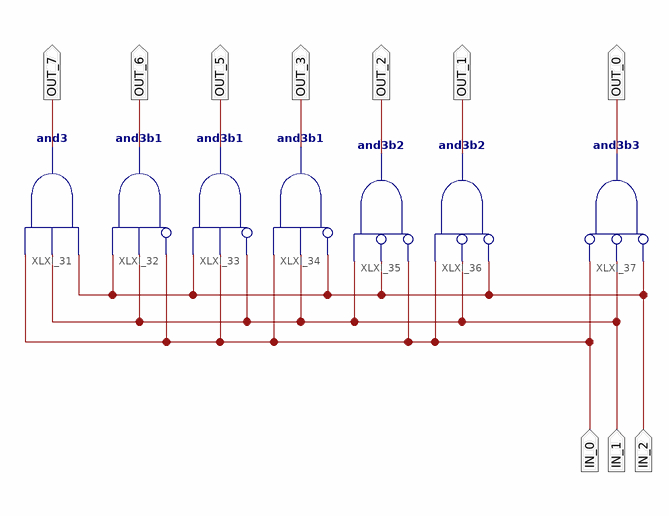
[diagram p0: schematic sheet 1]
// Xilinx ISE schematic My2L2Decoder.sch (spartan3a) as structural Verilog: 7 symbols, 10 ports
module My2L2Decoder (
  input  IN_0,
  input  IN_1,
  input  IN_2,
  output OUT_7,
  output OUT_6,
  output OUT_5,
  output OUT_3,
  output OUT_2,
  output OUT_1,
  output OUT_0
);

  and XLXI_31 (OUT_7, IN_2, IN_1, IN_0);
  and XLXI_32 (OUT_6, ~IN_0, IN_1, IN_2);  // and3b1
  and XLXI_33 (OUT_5, ~IN_1, IN_0, IN_2);  // and3b1
  and XLXI_34 (OUT_3, ~IN_2, IN_1, IN_0);  // and3b1
  and XLXI_35 (OUT_2, ~IN_0, ~IN_2, IN_1);  // and3b2
  and XLXI_36 (OUT_1, ~IN_2, ~IN_1, IN_0);  // and3b2
  and XLXI_37 (OUT_0, ~IN_2, ~IN_1, ~IN_0);  // and3b3
endmodule
